# EasyEDA Pro project backup.epro, schematic SCH
Create Date: 2024-03-14; Page Name: P1; Project Name: ip2366; Schematic Name: SCH; Update Date: 2024-03-22; Drawed: luq; Page Size: A3; Version: V1.0
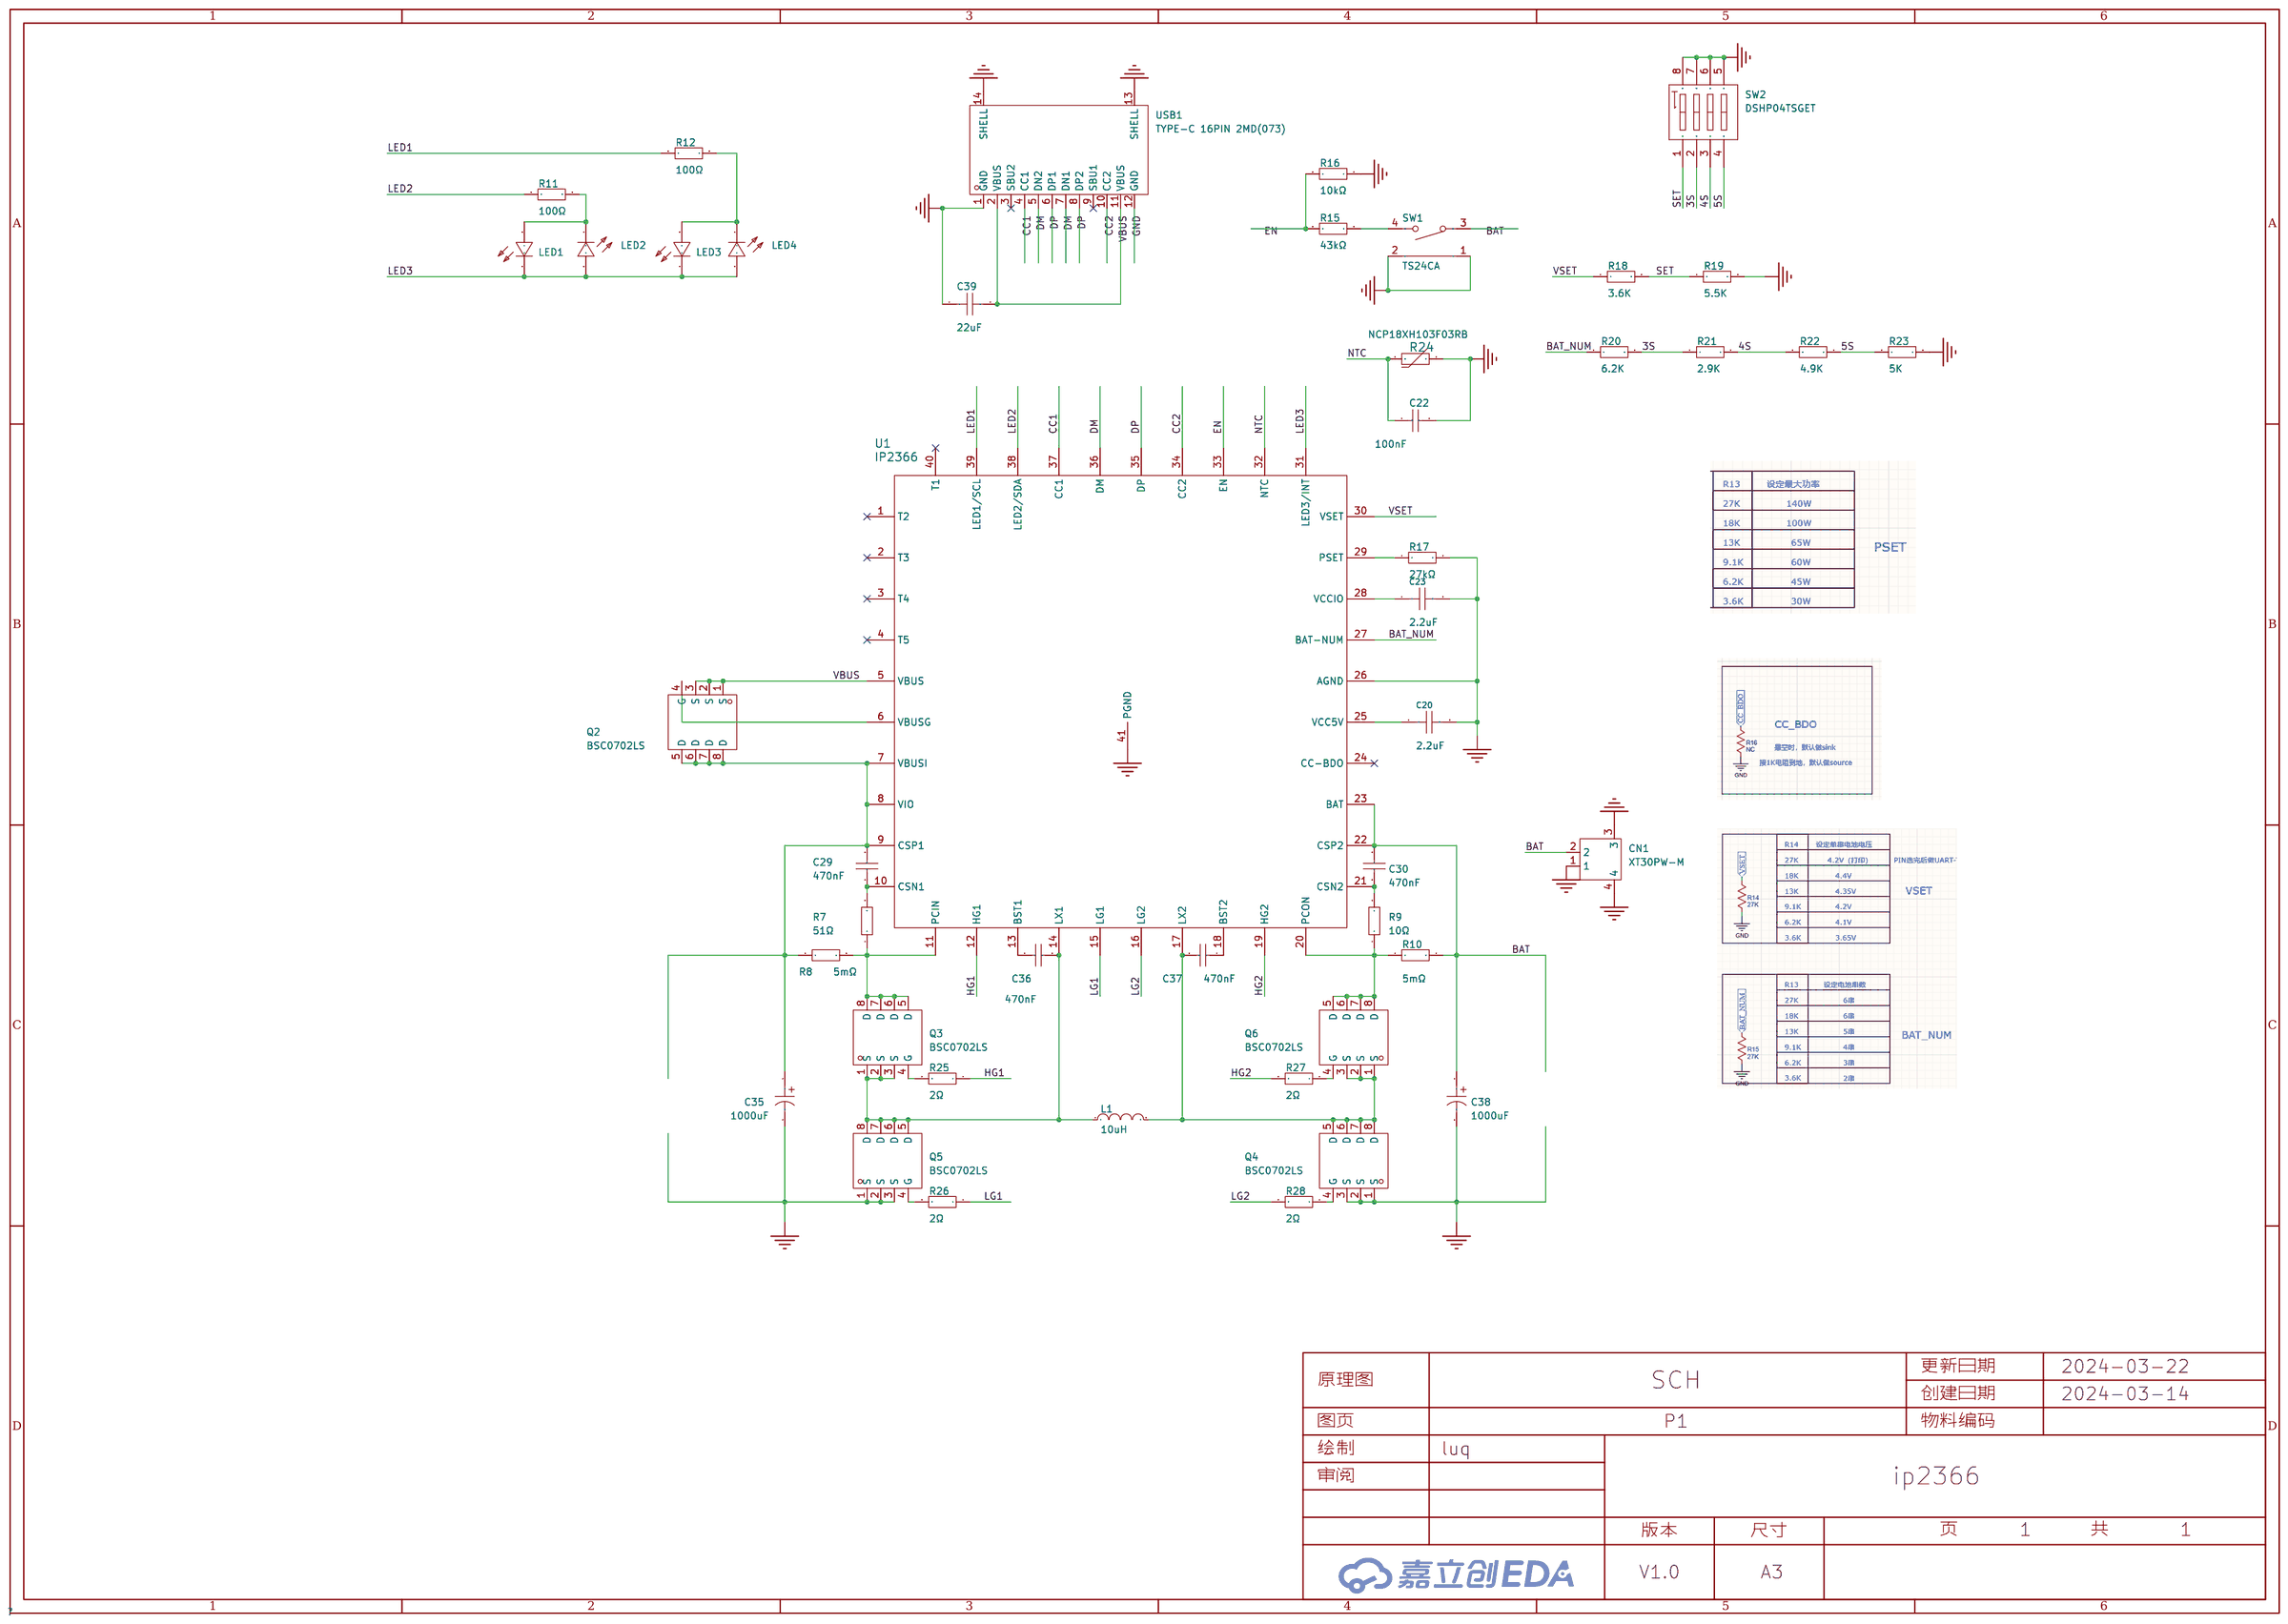
[diagram p0: schematic sheet]

## Parts
C20  2.2uF  [C0603]
C22  100nF  [C0603]
C23  2.2uF  [C0603]
C29  470nF  [C0603]
C30  470nF  [C0603]
C35  1000uF  [CAP-TH_BD10.0-P5.00-D0.6-FD-A]
C36  470nF  [C0603]
C37  470nF  [C0603]
C38  1000uF  [CAP-TH_BD10.0-P5.00-D0.6-FD-A]
C39  22uF  [C0603]
CN1  XT30PW-M  [CONN-TH_XT30PW-M]
L1  10uH  [IND-SMD_L12.6-W13.5]
LED1  NCD0603R1  [LED0603-RD_RED]
LED2  NCD0603R1  [LED0603-RD_RED]
LED3  NCD0603R1  [LED0603-RD_RED]
LED4  NCD0603R1  [LED0603-RD_RED]
Q2  BSC0702LS  [PG-TDSON-8_L5.0-W6.0-P1.27-BL-EP]
Q3  BSC0702LS  [PG-TDSON-8_L5.0-W6.0-P1.27-BL-EP]
Q4  BSC0702LS  [PG-TDSON-8_L5.0-W6.0-P1.27-BL-EP]
Q5  BSC0702LS  [PG-TDSON-8_L5.0-W6.0-P1.27-BL-EP]
Q6  BSC0702LS  [PG-TDSON-8_L5.0-W6.0-P1.27-BL-EP]
R7  51Ω  [R0603]
R8  5mΩ  [R1206]
R9  10Ω  [R0603]
R10  5mΩ  [R1206]
R11  100Ω  [R0603]
R12  100Ω  [R0603]
R15  43kΩ  [R0603]
R16  10kΩ  [R0603]
R17  27kΩ  [R0603]
R18  3.6K  [R0603]
R19  5.5K  [R0603]
R20  6.2K  [R0603]
R21  2.9K  [R0603]
R22  4.9K  [R0603]
R23  5K  [R0603]
R24  NCP18XH103F03RB  [R0603]
R25  2Ω  [R0603]
R26  2Ω  [R0603]
R27  2Ω  [R0603]
R28  2Ω  [R0603]
SW1  TS24CA  [SW-SMD_TS24CA]
SW2  DSHP04TSGET  [SW-SMD_8P-L6.7-W5.4-P1.27-LS8.4]
U1  IP2366  [IP2366]
USB1  TYPE-C 16PIN 2MD(073)  [USB-C-SMD_TYPE-C-6PIN-2MD-073]

## Library data of the parts
C20 C23 = CL10A225KB8NNNC: 容值:2.2uF;精度:±10%;额定电压:50V;材质(温度系数):X5R;; LCSC Part Name: 2.2uF ±10% 50V; Supplier Part: C913904; Manufacturer: SAMSUNG(三星); Supplier Footprint: 0603; JLCPCB Part Class: Extended Part; Datasheet: https://atta.szlcsc.com/upload/public/pdf/source/20160218/1457707763339.pdf; Supplier: LCSC; Tolerance: ±10%; Voltage Rated: 50V; Temperature Coefficient: X5R
C22 = 0603B104K500NT: 容值:100nF;精度:±10%;额定电压:50V;材质(温度系数):X7R;; LCSC Part Name: 100nF ±10% 50V; Supplier Part: C30926; Manufacturer: FH(风华); Supplier Footprint: 0603; JLCPCB Part Class: Extended Part; Datasheet: https://atta.szlcsc.com/upload/public/pdf/source/20200305/C486355_26A10D38EF8C2A5C37091D0039909270.pdf; Supplier: LCSC; Tolerance: ±10%; Voltage Rated: 50V; Temperature Coefficient: X7R
C29 C30 C36 C37 = 0603B474K500NT: 容值:470nF;精度:±10%;额定电压:50V;材质(温度系数):X7R;; LCSC Part Name: 470nF ±10% 50V; Supplier Part: C77572; Manufacturer: FH(风华); Supplier Footprint: 0603; JLCPCB Part Class: Extended Part; Datasheet: https://atta.szlcsc.com/upload/public/pdf/source/20200305/C486355_26A10D38EF8C2A5C37091D0039909270.pdf; Supplier: LCSC; Tolerance: ±10%; Voltage Rated: 50V; Temperature Coefficient: X7R
C35 C38 = ZE11000UF35V119EC0014: 容值:1000uF;精度:±20%;额定电压:35V;纹波电流:6.2A@100kHz;等效串联电阻:8mΩ@100kHz;; LCSC Part Name: 1000uF ±20% 35V; Supplier Part: C2992586; Manufacturer: KNSCHA(科尼盛); Supplier Footprint: 插件,D10xL17mm; JLCPCB Part Class: 扩展库; Datasheet: https://atta.szlcsc.com/upload/public/pdf/source/20220418/57B24F92C08E224D784EAACECC03E503.pdf; Supplier: LCSC; Tolerance: ±20%; Rated Voltage: 35V; Ripple Current: 6.2A@100kHz; Equivalent Series Resistance(ESR): 8mΩ@100kHz; Lead Spacing: 5mm; φD: 10mm; L: 17mm; Lifetime @ Temp: 2000hrs@105℃; Operating Temperature: -40℃~+105℃
C39 = CAP_0603: Supplier Footprint: 0603
CN1 = XT30PW-M: 类别:-;类型1:-;; LCSC Part Name: AMASS(艾迈斯)航模插头 卧式弯脚 XT30PW-M公头; Supplier Part: C431092; Manufacturer: AMASS(艾迈斯); JLCPCB Part Class: 扩展库; Datasheet: https://atta.szlcsc.com/upload/public/pdf/source/20220222/6A9F22F7850E25B33E1BE430ADF8560B.pdf; Supplier: LCSC; Brand: 艾迈斯; Type: 航模插头; RatedVoltage: DC 500V; InterfaceType: 公头; RatedCurrent: 15A; RecommendedWireGauge: 16/18/20AWG; contact resistance: 1.2mΩ; specifications: 2pin
L1 = FXL1360-100-M: 电感值:10uH;精度:±20%;额定电流:10A;饱和电流(Isat):12.5A;类型:一体成型电感;; LCSC Part Name: 10uH ±20% 12.5A; Supplier Part: C526024; Manufacturer: cjiang(长江微电); Supplier Footprint: SMD,12.6x13.5mm; JLCPCB Part Class: 扩展库; Datasheet: https://atta.szlcsc.com/upload/public/pdf/source/20230516/EDBB5FB099B441B256CFB4945AE848AD.pdf; Supplier: LCSC; Tolerance: ±20%; Rated Current: 10A; Saturation Current (Isat): 12.5A; DC Resistance (DCR): 20.7mΩ; Type: 一体成型电感
LED1-LED4 = NCD0603R1_C84263: 灯头类型:-;发光颜色:红色;正向电压(VF):1.6V~2.6V;功率:65mW;正向电流:20mA;主波长:615nm~630nm;二极管配置:独立二极管;透镜颜色:无色透明透镜;色温:-;发光强度:80mcd~220mcd;发光角度:130°;载带方式:-;工作温度:-30℃~+85℃;; Supplier Part: C84263; Manufacturer: 国星光电; Supplier Footprint: 0603; JLCPCB Part Class: Extended Part; Datasheet: https://atta.szlcsc.com/upload/public/pdf/source/20200820/C84263_DABC6A75E58F576973B407FDBA283D60.pdf; Supplier: LCSC; Emitted Color: 红色; Forward Voltage (VF): 1.6V~2.6V; Power Dissipation: 65mW; Forward Current: 20mA; Dominant Wavelength: 615nm~630nm; Diode Configuration: 独立二极管; Lens Color: 无色透明透镜; Luminous Intensity: 80mcd~220mcd; Viewing Angle: 130°; Operating Temperature: -30℃~+85℃
Q2-Q6 = BSC0702LS: 类型:N沟道;漏源电压(Vdss):60V;连续漏极电流(Id):100A;功率(Pd):83W;导通电阻(RDS(on)@Vgs,Id):2.3mΩ@10V,50A;阈值电压(Vgs(th)@Id):2.3V@49uA;; LCSC Part Name: N沟道 耐压:60V 电流:100A; Supplier Part: C501503; Manufacturer: Infineon(英飞凌); Supplier Footprint: TDSON-8-EP(5x6); JLCPCB Part Class: 扩展库; Datasheet: https://atta.szlcsc.com/upload/public/pdf/source/20200324/C501503_BE3C55BAEEDCAD77F3934BFEE5415F86.pdf; Supplier: LCSC; Type: N沟道; Drain Source Voltage (Vdss): 60V; Continuous Drain Current (Id): 100A; Power Dissipation (Pd): 83W; Drain Source On Resistance (RDS(on)@Vgs,Id): 2.3mΩ@10V,50A; Gate Threshold Voltage (Vgs(th)@Id): 2.3V@49uA
R7 R25-R28 = 0603WAF510JT5E: 电阻类型:厚膜电阻;阻值:51Ω;精度:±1%;功率:100mW;最大工作电压:75V;温度系数:±100ppm/℃;; LCSC Part Name: 51Ω ±1% 100mW 厚膜电阻; Supplier Part: C23197; Manufacturer: UNI-ROYAL(厚声); Supplier Footprint: 0603; JLCPCB Part Class: Basic Part; Datasheet: https://atta.szlcsc.com/upload/public/pdf/source/20200306/C422600_1E6D84923E4A46A82E41ADD87F860B5C.pdf; Supplier: LCSC; Type: 厚膜电阻; Tolerance: ±1%; Power(Watts): 100mW; Overload Voltage (Max): 75V; Temperature Coefficient: ±100ppm/℃; Operating Temperature Range: -55℃~+155℃
R8 R10 = RLM12FTCMR005: 阻值:5mΩ;精度:±1%;功率:1W;温度系数:±100ppm/℃;; LCSC Part Name: 5mΩ ±1% 1W; Supplier Part: C316225; Manufacturer: 大毅科技; Supplier Footprint: 1206; JLCPCB Part Class: Extended Part; Datasheet: https://atta.szlcsc.com/upload/public/pdf/source/20181023/C316226_D363EC3D88B44FBEE1B74F4A1DF43EB9.pdf; Supplier: LCSC; Tolerance: ±1%; Power(Watts): 1W; Temperature Coefficient: ±100ppm/℃
R9 = 0603WAF100JT5E: 电阻类型:厚膜电阻;阻值:10Ω;精度:±1%;功率:100mW;最大工作电压:75V;温度系数:±400ppm/℃;; LCSC Part Name: 10Ω ±1% 100mW 厚膜电阻; Supplier Part: C22859; Manufacturer: UNI-ROYAL(厚声); Supplier Footprint: 0603; JLCPCB Part Class: Basic Part; Datasheet: https://atta.szlcsc.com/upload/public/pdf/source/20200306/C422600_1E6D84923E4A46A82E41ADD87F860B5C.pdf; Supplier: LCSC; Type: 厚膜电阻; Tolerance: ±1%; Power(Watts): 100mW; Overload Voltage (Max): 75V; Temperature Coefficient: ±400ppm/℃; Operating Temperature Range: -55℃~+155℃
R11 R12 = RC0603FR-07100RL: 电阻类型:厚膜电阻;阻值:100Ω;精度:±1%;功率:100mW;最大工作电压:75V;温度系数:±100ppm/℃;; LCSC Part Name: 厚膜电阻 100Ω ±1% 100mW; Supplier Part: C105588; Manufacturer: YAGEO(国巨); Supplier Footprint: 0603; JLCPCB Part Class: Extended Part; Datasheet: https://atta.szlcsc.com/upload/public/pdf/source/20180316/70C0E2BDAE7FCC62C531A5A58D202EE1.pdf; Supplier: LCSC; Type: 厚膜电阻; Tolerance: ±1%; Power(Watts): 100mW; Overload Voltage (Max): 75V; Temperature Coefficient: ±100ppm/℃; Operating Temperature Range: -55℃~+155℃
R15 = 0603WAF4302T5E: 电阻类型:厚膜电阻;阻值:43kΩ;精度:±1%;功率:100mW;最大工作电压:75V;温度系数:±100ppm/℃;; LCSC Part Name: 43kΩ ±1% 100mW 厚膜电阻; Supplier Part: C23172; Manufacturer: UNI-ROYAL(厚声); Supplier Footprint: 0603; JLCPCB Part Class: Extended Part; Datasheet: https://atta.szlcsc.com/upload/public/pdf/source/20200306/C422600_1E6D84923E4A46A82E41ADD87F860B5C.pdf; Supplier: LCSC; Type: 厚膜电阻; Tolerance: ±1%; Power(Watts): 100mW; Overload Voltage (Max): 75V; Temperature Coefficient: ±100ppm/℃; Operating Temperature Range: -55℃~+155℃
R16 = 0603WAF1002T5E: 电阻类型:厚膜电阻;阻值:10kΩ;精度:±1%;功率:100mW;最大工作电压:75V;温度系数:±100ppm/℃;; LCSC Part Name: 厚膜电阻 10kΩ ±1% 100mW; Supplier Part: C25804; Manufacturer: UNI-ROYAL(厚声); Supplier Footprint: 0603; JLCPCB Part Class: Basic Part; Datasheet: https://atta.szlcsc.com/upload/public/pdf/source/20200306/C422600_1E6D84923E4A46A82E41ADD87F860B5C.pdf; Supplier: LCSC; Type: 厚膜电阻; Tolerance: ±1%; Power(Watts): 100mW; Overload Voltage (Max): 75V; Temperature Coefficient: ±100ppm/℃; Operating Temperature Range: -55℃~+155℃
R17 = 0603WAF2702T5E: 电阻类型:厚膜电阻;阻值:27kΩ;精度:±1%;功率:100mW;最大工作电压:75V;温度系数:±100ppm/℃;; LCSC Part Name: 27kΩ ±1% 100mW 厚膜电阻; Supplier Part: C22967; Manufacturer: UNI-ROYAL(厚声); Supplier Footprint: 0603; JLCPCB Part Class: Basic Part; Datasheet: https://atta.szlcsc.com/upload/public/pdf/source/20200306/C422600_1E6D84923E4A46A82E41ADD87F860B5C.pdf; Supplier: LCSC; Type: 厚膜电阻; Tolerance: ±1%; Power(Watts): 100mW; Overload Voltage (Max): 75V; Temperature Coefficient: ±100ppm/℃; Operating Temperature Range: -55℃~+155℃
R18-R23 = Res_0603: Supplier Footprint: 0603
R24 = NCP18XH103F03RB: 阻值(25℃):10kΩ;B值(25℃/50℃):3380K;电阻精度:±1%;功率:100mW;B值精度:±1%;最大稳态电流(25℃):310uA;; LCSC Part Name: 10kΩ 电阻精度:±1% 3380K; Supplier Part: C13564; Manufacturer: muRata(村田); Supplier Footprint: 0603; JLCPCB Part Class: 扩展库; Datasheet: https://atta.szlcsc.com/upload/public/pdf/source/20130819/1457706638081.pdf; Supplier: LCSC; Resistance @ 25℃: 10kΩ; B Constant (25℃/50℃): 3380K; Resistance Tolerance: ±1%; B Constant (25℃/85℃): 3434K; B Constant (25℃/100℃): 3455K; Power: 100mW; B Constant Tolerance: ±1%; Steady State Current (Max): 310uA; Operating Temperature: -40℃~+125℃
SW1 = TS24CA: 电路结构:单刀单掷;按钮形状:矩形按钮;安装方式:卧贴;开关长度:4.55mm;开关宽度:1.8mm;开关高度:3.5mm;触点电流:50mA;额定电压(DC):12V;带灯:-;机械寿命:-;; LCSC Part Name: 4.55*1.8*3.5mm 卧贴 轻触开关; Supplier Part: C393942; Manufacturer: SHOU HAN(首韩); Supplier Footprint: SMD; JLCPCB Part Class: 扩展库; Datasheet: https://atta.szlcsc.com/upload/public/pdf/source/20190521/C393942_591A9E318887EFA4274D34029981AD99.pdf; Supplier: LCSC; Circuit: 单刀单掷; Actuator Style: 矩形按钮; Mounting Style: 卧贴; Switch Length: 4.55mm; Switch Width: 1.8mm; Switch Height: 3.5mm; Contact Current: 50mA; Voltage Rating (DC): 12V
SW2 = DSHP04TSGET: 类型:平拨,凹槽式;电路结构:单刀单掷;开关位数:4位;使用寿命:-;颜色:黑色;; LCSC Part Name: 4位 1.27间距 拨码开关; Supplier Part: C40736; Manufacturer: YE; Supplier Footprint: SMD-8P,5.4x6.6mm; JLCPCB Part Class: 扩展库; Datasheet: https://atta.szlcsc.com/upload/public/pdf/source/20150928/1457707425288.pdf; Supplier: LCSC; Type: 平拨,凹槽式; Circuit: 单刀单掷; Number of Positions: 4位; Lead Pitch: 1.27mm; Color: 黑色
U1 = IP2366
USB1 = TYPE-C 16PIN 2MD(073): 连接器类型:Type-C;标准:-;公母:母;端口数量:1;触点数量:16P;安装方式:卧贴;额定电流 - 电源:5A;工作温度范围:-25℃~+85℃;; LCSC Part Name: Type-C 母 卧贴; Supplier Part: C2765186; Manufacturer: SHOU HAN(首韩); Supplier Footprint: SMD; JLCPCB Part Class: 扩展库; Datasheet: https://atta.szlcsc.com/upload/public/pdf/source/20211123/39B17C16241EAC15C5E277BDA434118E.pdf; Supplier: LCSC; Connector Type: Type-C; Gender: 母; Number of Ports: 1; Number of Contacts: 16P; Mounting Style: 卧贴; Current Rating - Power (Max): 5A; Operating Temperature Range: -25℃~+85℃

## Nets
GND: C20.2 C22.2 C23.2 C35.2 C38.2 C39.1 CN1.1 CN1.3 CN1.4 Q4.1(S) Q4.2(S) Q4.3(S) Q5.1(S) Q5.2(S) Q5.3(S) R16.1 R17.2 R19.2 R23.2 R24.2 SW1.1 SW1.2 SW2.5(B4) SW2.6(B3) SW2.7(B2) SW2.8(B1) U1.26(AGND) U1.41(PGND) USB1.1(GND) USB1.12(GND) USB1.13(SHELL) USB1.14(SHELL)
VBUS: C39.2 Q2.1(S) Q2.2(S) Q2.3(S) U1.5(VBUS) USB1.2(VBUS) USB1.11(VBUS)
3S: R20.2 R21.1 SW2.2(A2)
4S: R21.2 R22.1 SW2.3(A3)
5S: R22.2 R23.1 SW2.4(A4)
BAT: C30.2 C38.1 CN1.2 R10.2 SW1.3 U1.22(CSP2) U1.23(BAT)
BAT_NUM: R20.1 U1.27(BAT-NUM)
CC1: U1.37(CC1) USB1.4(CC1)
CC2: U1.34(CC2) USB1.10(CC2)
DM: U1.36(DM) USB1.5(DN2) USB1.7(DN1)
DP: U1.35(DP) USB1.6(DP1) USB1.8(DP2)
EN: R15.2 R16.2 U1.33(EN)
HG1: R25.1 U1.12(HG1)
HG2: R27.2 U1.19(HG2)
LED1: R12.1 U1.39(LED1/SCL)
LED2: R11.1 U1.38(LED2/SDA)
LED3: LED1.1(K) LED2.2(A) LED3.1(K) LED4.2(A) U1.31(LED3/INT)
LG1: R26.1 U1.15(LG1)
LG2: R28.2 U1.16(LG2)
NTC: C22.1 R24.1 U1.32(NTC)
SET: R18.2 R19.1 SW2.1(A1)
VSET: R18.1 U1.30(VSET)
$C20_1: C20.1 U1.25(VCC5V)
$C23_1: C23.1 U1.28(VCCIO)
$C29_1: C29.1 R7.2 U1.10(CSN1)
$C29_2: C29.2 C35.1 Q2.5(D) Q2.6(D) Q2.7(D) Q2.8(D) R8.1 U1.7(VBUSI) U1.8(VIO) U1.9(CSP1)
$C30_1: C30.1 R9.2 U1.21(CSN2)
$C36_1: C36.1 U1.13(BST1)
$C36_2: C36.2 L1.1 Q3.1(S) Q3.2(S) Q3.3(S) Q5.5(D) Q5.6(D) Q5.7(D) Q5.8(D) U1.14(LX1)
$C37_1: C37.1 U1.18(BST2)
$C37_2: C37.2 L1.2 Q4.5(D) Q4.6(D) Q4.7(D) Q4.8(D) Q6.1(S) Q6.2(S) Q6.3(S) U1.17(LX2)
$LED1_2: LED1.2(A) LED2.1(K) R11.2
$LED3_2: LED3.2(A) LED4.1(K) R12.2
$Q2_4: Q2.4(G) U1.6(VBUSG)
$Q3_4: Q3.4(G) R25.2
$Q3_5: Q3.5(D) Q3.6(D) Q3.7(D) Q3.8(D) R7.1 R8.2 U1.11(PCIN)
$Q4_4: Q4.4(G) R28.1
$Q5_4: Q5.4(G) R26.2
$Q6_4: Q6.4(G) R27.1
$Q6_5: Q6.5(D) Q6.6(D) Q6.7(D) Q6.8(D) R9.1 R10.1 U1.20(PCON)
$R15_1: R15.1 SW1.4
$R17_1: R17.1 U1.29(PSET)

Not connected (* = marked no-connect by the designer): U1 1(T2)* 2(T3)* 3(T4)* 4(T5)* 24(CC-BDO)* 40(T1)*; USB1 3(SBU2)* 9(SBU1)*
